# EAGLE board protoBot (EAGLE 6.3), part 1 of 2
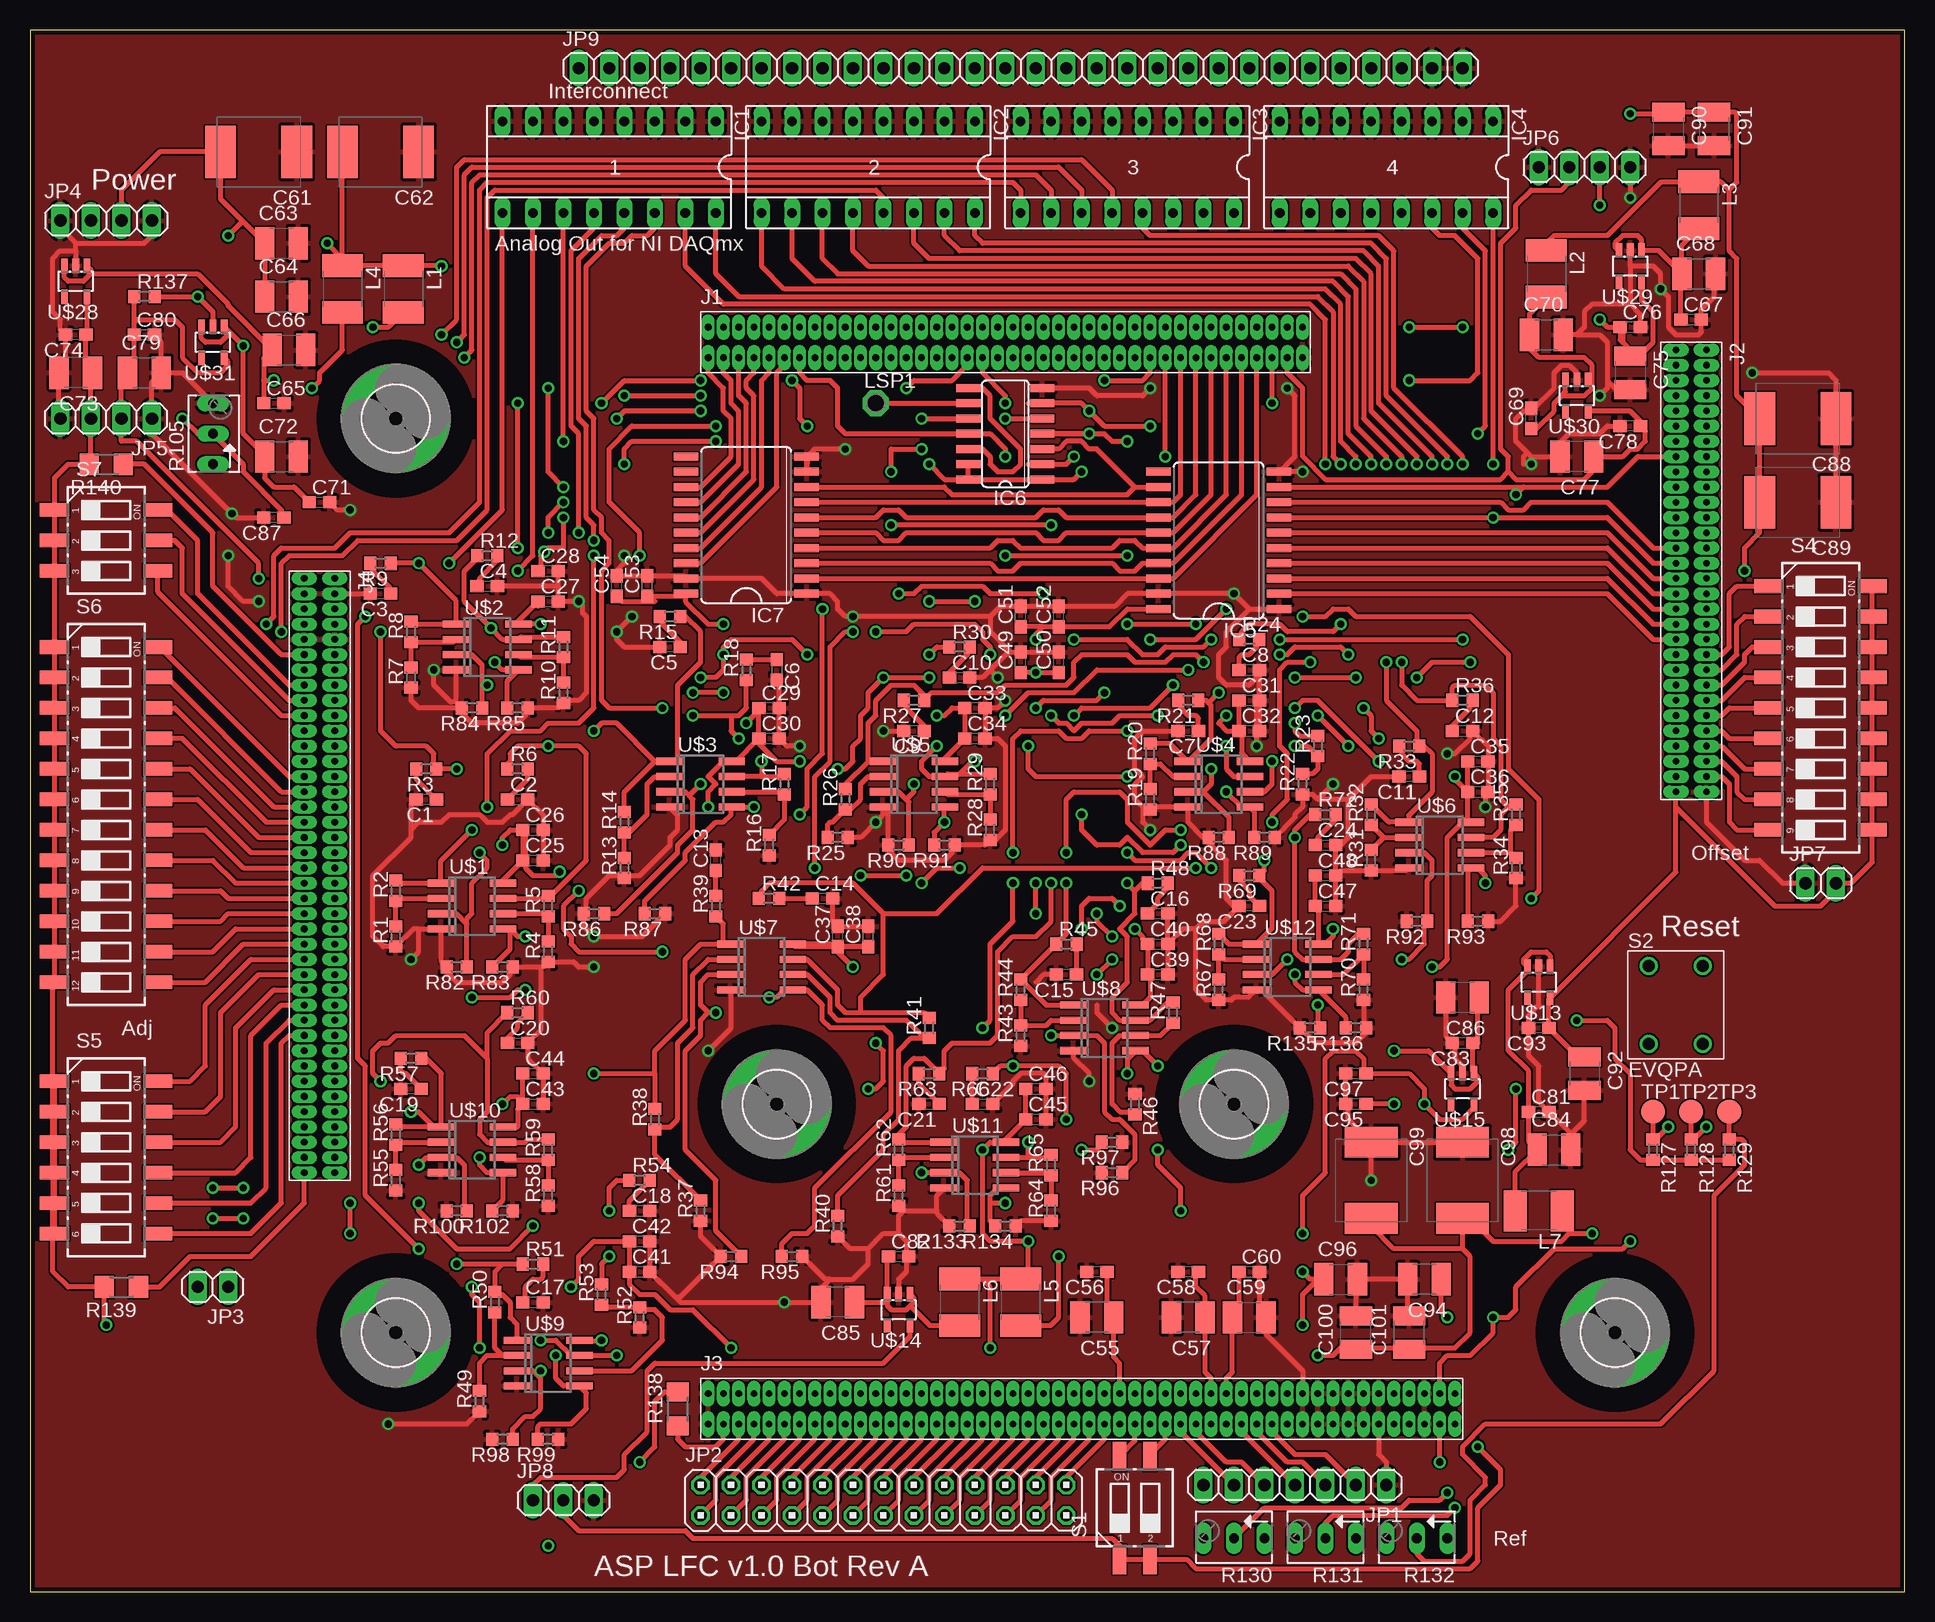
[diagram p6: board, top side]
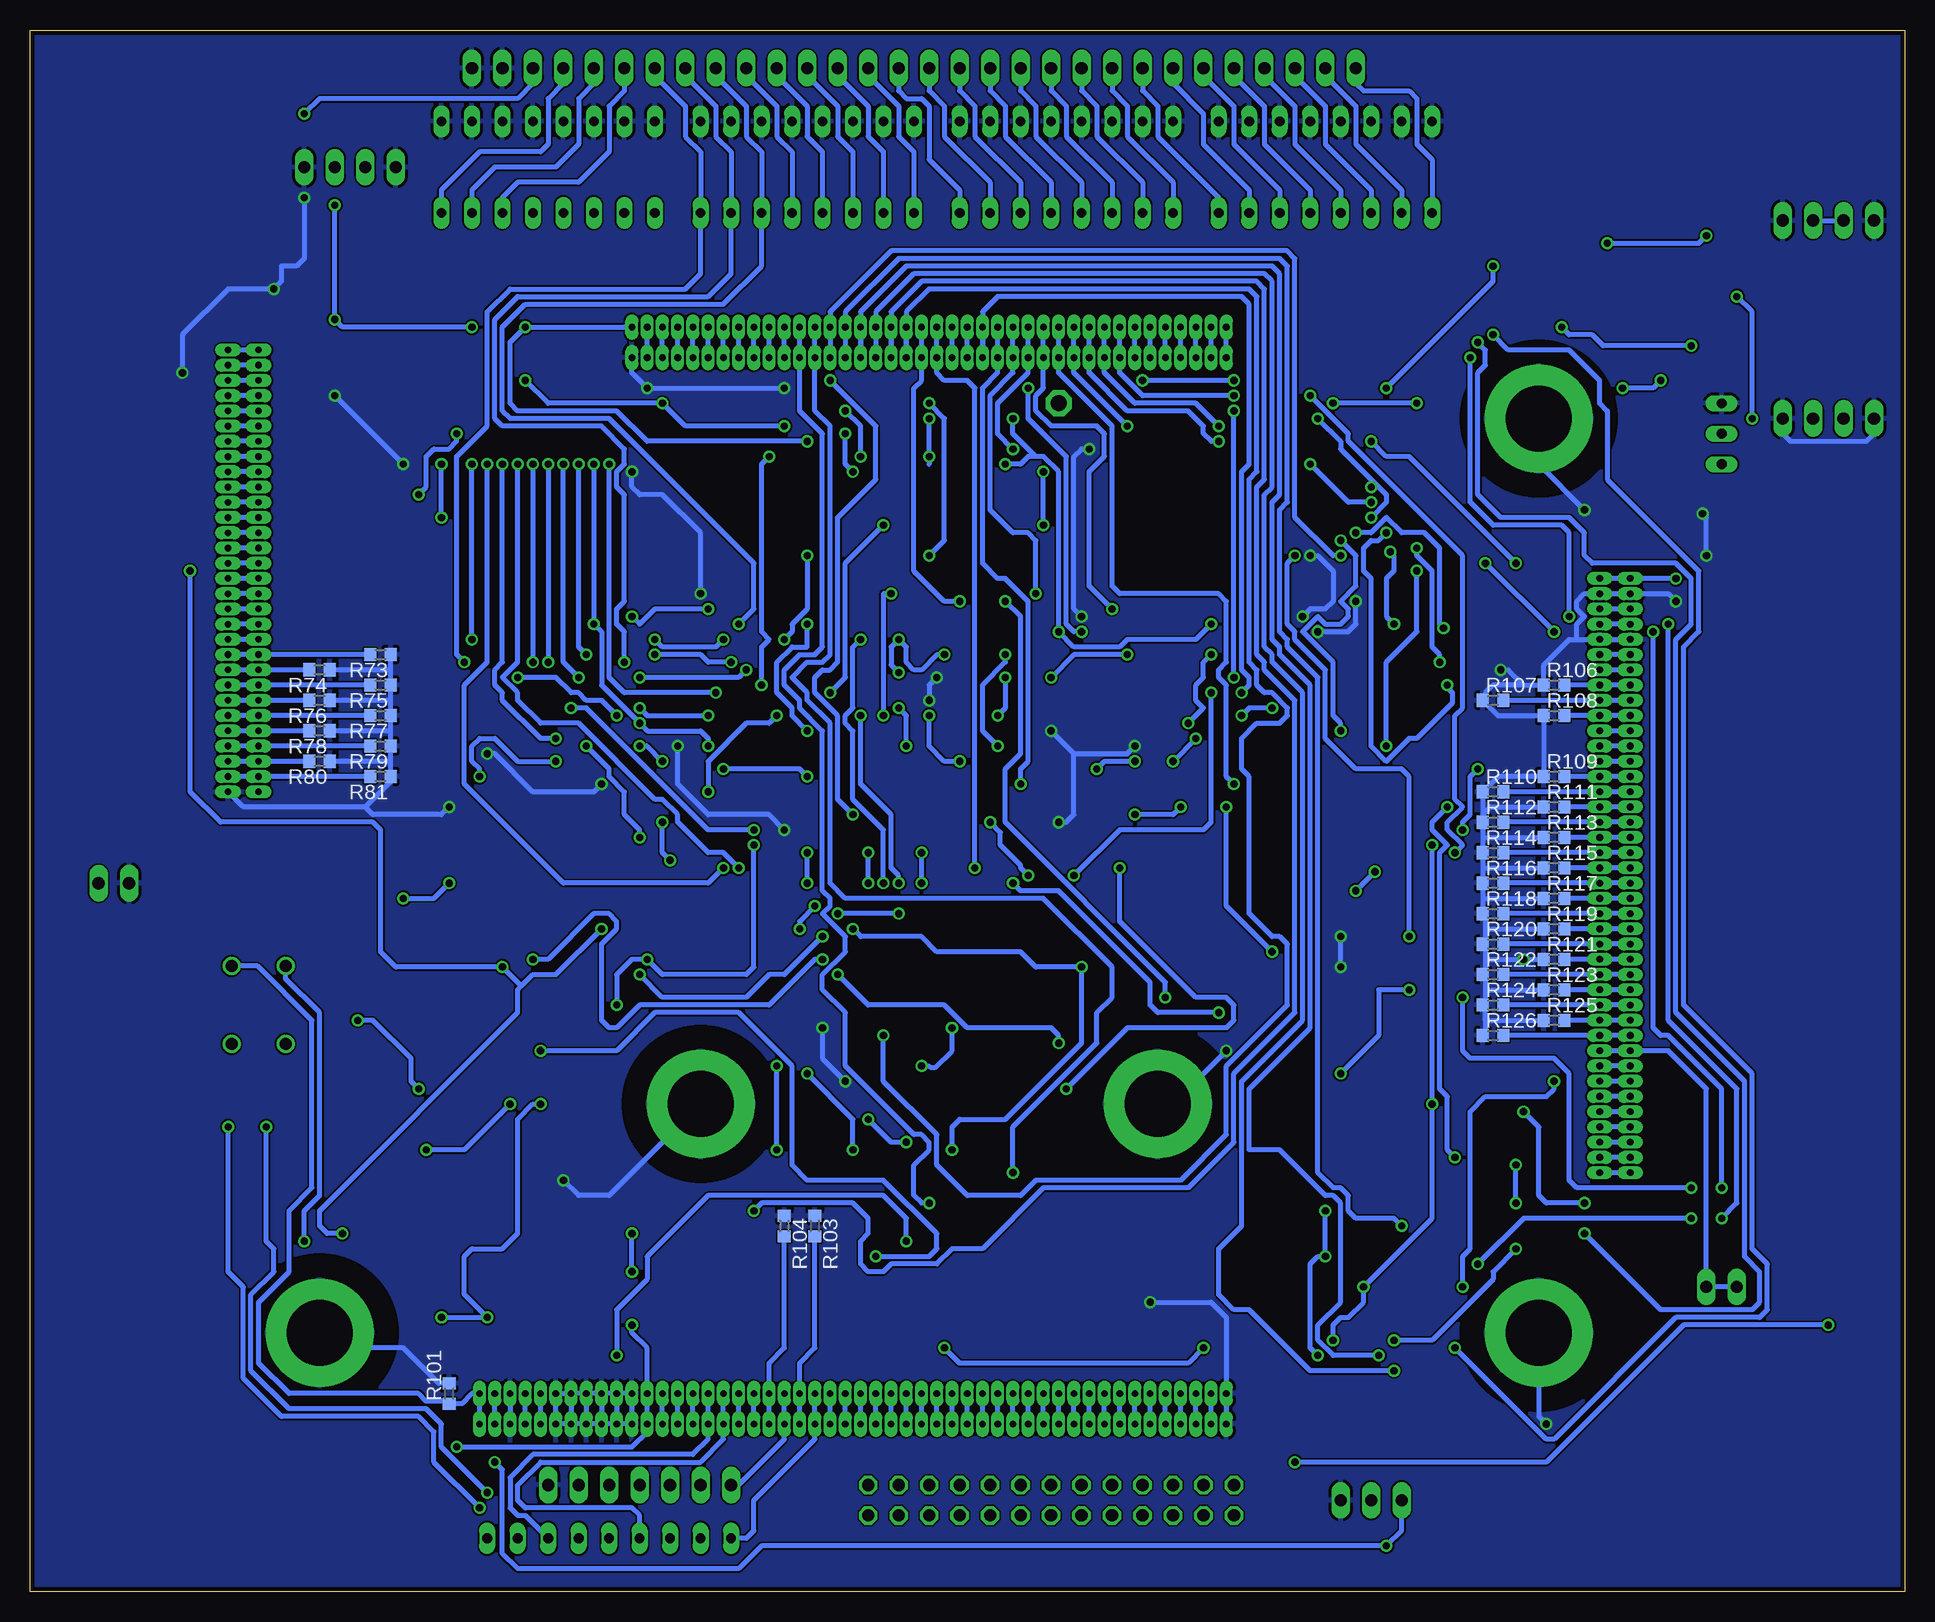
[diagram p7: board, bottom side, seen from below]

Size 156.21 x 130.18 mm. Coordinates in mm from the lower left corner, seen from the top.
Outline: 0,0 156.21,0 156.21,130.18 0,130.18 0,0
Copper layers (1*16): Top 0.035559375mm / dielectric 1.501140625mm / Bottom 0.035559375mm
Design rules "typical_4pcb": minimum track width 10mil, minimum drill 15mil, track to track 6mil, track to pad 6mil, pad to pad 6mil, via to via 6mil, smd to smd 6mil, copper to edge 15mil, drill to drill 8mil, minimum pad ring 10mil, minimum via ring 8mil, stop-mask expansion 4mil, vias tented up to drill 0mil, thermal gap 10mil

## Footprints (pad centres in the part's own frame; a part is rotated, then mirrored left to right if it is on the bottom)
C0603 = smd 1.1 x 1: 1 -0.85,0; 2 0.85,0
C1210 = smd 1.6 x 2.7: 1 -1.4,0; 2 1.4,0
E/7260-38R = smd 2.55 x 4.4: + 3.175,0; - -3.175,0
5,5-PAD = drill 5.5 pad 9: B5,5 0,0
SOCKET-16 = drill 0.813 long: 1 -8.89,-3.81; 2 -6.35,-3.81; 3 -3.81,-3.81; 4 -1.27,-3.81; 5 1.27,-3.81; 6 3.81,-3.81; 7 6.35,-3.81; 8 8.89,-3.81; 9 8.89,3.81; 10 6.35,3.81; 11 3.81,3.81; 12 1.27,3.81; 13 -1.27,3.81; 14 -3.81,3.81; 15 -6.35,3.81; 16 -8.89,3.81
SO20W = smd 0.66 x 2.032: 1 -5.715,-5.029; 2 -4.445,-5.029; 3 -3.175,-5.029; 4 -1.905,-5.029; 5 -0.635,-5.029; 6 0.635,-5.029; 7 1.905,-5.029; 8 3.175,-5.029; 9 4.445,-5.029; 10 5.715,-5.029; 11 5.715,5.029; 12 4.445,5.029; 13 3.175,5.029; 14 1.905,5.029; 15 0.635,5.029; 16 -0.635,5.029; 17 -1.905,5.029; 18 -3.175,5.029; 19 -4.445,5.029; 20 -5.715,5.029
SO14 = smd 0.66 x 2.032: 1 -3.81,-3.073; 2 -2.54,-3.073; 3 -1.27,-3.073; 4 0,-3.073; 5 1.27,-3.073; 6 2.54,-3.073; 7 3.81,-3.073; 8 3.81,3.073; 9 2.54,3.073; 10 1.27,3.073; 11 0,3.073; 12 -1.27,3.073; 13 -2.54,3.073; 14 -3.81,3.073
AMPMODU50-80 = drill 0.559 pad 0.889 long: 1 -24.765,1.27; 2 -24.765,-1.27; 3 -23.495,1.27; 4 -23.495,-1.27; 5 -22.225,1.27; 6 -22.225,-1.27; 7 -20.955,1.27; 8 -20.955,-1.27; 9 -19.685,1.27; 10 -19.685,-1.27; 11 -18.415,1.27; 12 -18.415,-1.27; 13 -17.145,1.27; 14 -17.145,-1.27; 15 -15.875,1.27; 16 -15.875,-1.27; 17 -14.605,1.27; 18 -14.605,-1.27; 19 -13.335,1.27; 20 -13.335,-1.27; 21 -12.065,1.27; 22 -12.065,-1.27; 23 -10.795,1.27; 24 -10.795,-1.27; 25 -9.525,1.27; 26 -9.525,-1.27; 27 -8.255,1.27; 28 -8.255,-1.27; 29 -6.985,1.27; 30 -6.985,-1.27; 31 -5.715,1.27; 32 -5.715,-1.27; 33 -4.445,1.27; 34 -4.445,-1.27; 35 -3.175,1.27; 36 -3.175,-1.27; 37 -1.905,1.27; 38 -1.905,-1.27; 39 -0.635,1.27; 40 -0.635,-1.27; 41 0.635,1.27; 42 0.635,-1.27; 43 1.905,1.27; 44 1.905,-1.27; 45 3.175,1.27; 46 3.175,-1.27; 47 4.445,1.27; 48 4.445,-1.27; 49 5.715,1.27; 50 5.715,-1.27; 51 6.985,1.27; 52 6.985,-1.27; 53 8.255,1.27; 54 8.255,-1.27; 55 9.525,1.27; 56 9.525,-1.27; 57 10.795,1.27; 58 10.795,-1.27; 59 12.065,1.27; 60 12.065,-1.27; 61 13.335,1.27; 62 13.335,-1.27; 63 14.605,1.27; 64 14.605,-1.27; 65 15.875,1.27; 66 15.875,-1.27; 67 17.145,1.27; 68 17.145,-1.27; 69 18.415,1.27; 70 18.415,-1.27; 71 19.685,1.27; 72 19.685,-1.27; 73 20.955,1.27; 74 20.955,-1.27; 75 22.225,1.27; 76 22.225,-1.27; 77 23.495,1.27; 78 23.495,-1.27; 79 24.765,1.27; 80 24.765,-1.27
AMPMODU50-60 = drill 0.559 pad 0.889 long: 1 -18.415,1.27; 2 -18.415,-1.27; 3 -17.145,1.27; 4 -17.145,-1.27; 5 -15.875,1.27; 6 -15.875,-1.27; 7 -14.605,1.27; 8 -14.605,-1.27; 9 -13.335,1.27; 10 -13.335,-1.27; 11 -12.065,1.27; 12 -12.065,-1.27; 13 -10.795,1.27; 14 -10.795,-1.27; 15 -9.525,1.27; 16 -9.525,-1.27; 17 -8.255,1.27; 18 -8.255,-1.27; 19 -6.985,1.27; 20 -6.985,-1.27; 21 -5.715,1.27; 22 -5.715,-1.27; 23 -4.445,1.27; 24 -4.445,-1.27; 25 -3.175,1.27; 26 -3.175,-1.27; 27 -1.905,1.27; 28 -1.905,-1.27; 29 -0.635,1.27; 30 -0.635,-1.27; 31 0.635,1.27; 32 0.635,-1.27; 33 1.905,1.27; 34 1.905,-1.27; 35 3.175,1.27; 36 3.175,-1.27; 37 4.445,1.27; 38 4.445,-1.27; 39 5.715,1.27; 40 5.715,-1.27; 41 6.985,1.27; 42 6.985,-1.27; 43 8.255,1.27; 44 8.255,-1.27; 45 9.525,1.27; 46 9.525,-1.27; 47 10.795,1.27; 48 10.795,-1.27; 49 12.065,1.27; 50 12.065,-1.27; 51 13.335,1.27; 52 13.335,-1.27; 53 14.605,1.27; 54 14.605,-1.27; 55 15.875,1.27; 56 15.875,-1.27; 57 17.145,1.27; 58 17.145,-1.27; 59 18.415,1.27; 60 18.415,-1.27
AMPMODU50-100 = drill 0.559 pad 0.889 long: 1 -31.115,1.27; 2 -31.115,-1.27; 3 -29.845,1.27; 4 -29.845,-1.27; 5 -28.575,1.27; 6 -28.575,-1.27; 7 -27.305,1.27; 8 -27.305,-1.27; 9 -26.035,1.27; 10 -26.035,-1.27; 11 -24.765,1.27; 12 -24.765,-1.27; 13 -23.495,1.27; 14 -23.495,-1.27; 15 -22.225,1.27; 16 -22.225,-1.27; 17 -20.955,1.27; 18 -20.955,-1.27; 19 -19.685,1.27; 20 -19.685,-1.27; 21 -18.415,1.27; 22 -18.415,-1.27; 23 -17.145,1.27; 24 -17.145,-1.27; 25 -15.875,1.27; 26 -15.875,-1.27; 27 -14.605,1.27; 28 -14.605,-1.27; 29 -13.335,1.27; 30 -13.335,-1.27; 31 -12.065,1.27; 32 -12.065,-1.27; 33 -10.795,1.27; 34 -10.795,-1.27; 35 -9.525,1.27; 36 -9.525,-1.27; 37 -8.255,1.27; 38 -8.255,-1.27; 39 -6.985,1.27; 40 -6.985,-1.27; 41 -5.715,1.27; 42 -5.715,-1.27; 43 -4.445,1.27; 44 -4.445,-1.27; 45 -3.175,1.27; 46 -3.175,-1.27; 47 -1.905,1.27; 48 -1.905,-1.27; 49 -0.635,1.27; 50 -0.635,-1.27; 51 0.635,1.27; 52 0.635,-1.27; 53 1.905,1.27; 54 1.905,-1.27; 55 3.175,1.27; 56 3.175,-1.27; 57 4.445,1.27; 58 4.445,-1.27; 59 5.715,1.27; 60 5.715,-1.27; 61 6.985,1.27; 62 6.985,-1.27; 63 8.255,1.27; 64 8.255,-1.27; 65 9.525,1.27; 66 9.525,-1.27; 67 10.795,1.27; 68 10.795,-1.27; 69 12.065,1.27; 70 12.065,-1.27; 71 13.335,1.27; 72 13.335,-1.27; 73 14.605,1.27; 74 14.605,-1.27; 75 15.875,1.27; 76 15.875,-1.27; 77 17.145,1.27; 78 17.145,-1.27; 79 18.415,1.27; 80 18.415,-1.27; 81 19.685,1.27; 82 19.685,-1.27; 83 20.955,1.27; 84 20.955,-1.27; 85 22.225,1.27; 86 22.225,-1.27; 87 23.495,1.27; 88 23.495,-1.27; 89 24.765,1.27; 90 24.765,-1.27; 91 26.035,1.27; 92 26.035,-1.27; 93 27.305,1.27; 94 27.305,-1.27; 95 28.575,1.27; 96 28.575,-1.27; 97 29.845,1.27; 98 29.845,-1.27; 99 31.115,1.27; 100 31.115,-1.27
1X07 = drill 1.016 long: 1 -7.62,0; 2 -5.08,0; 3 -2.54,0; 4 0,0; 5 2.54,0; 6 5.08,0; 7 7.62,0
2X13 = drill 1.016 octagon: 1 -15.24,-1.27; 2 -15.24,1.27; 3 -12.7,-1.27; 4 -12.7,1.27; 5 -10.16,-1.27; 6 -10.16,1.27; 7 -7.62,-1.27; 8 -7.62,1.27; 9 -5.08,-1.27; 10 -5.08,1.27; 11 -2.54,-1.27; 12 -2.54,1.27; 13 0,-1.27; 14 0,1.27; 15 2.54,-1.27; 16 2.54,1.27; 17 5.08,-1.27; 18 5.08,1.27; 19 7.62,-1.27; 20 7.62,1.27; 21 10.16,-1.27; 22 10.16,1.27; 23 12.7,-1.27; 24 12.7,1.27; 25 15.24,-1.27; 26 15.24,1.27
1X02 = drill 1.016 long: 1 -1.27,0; 2 1.27,0
1X04 = drill 1.016 long: 1 -3.81,0; 2 -1.27,0; 3 1.27,0; 4 3.81,0
1X03 = drill 1.016 long: 1 -2.54,0; 2 0,0; 3 2.54,0
1X30 = drill 1.016 long: 1 -36.83,0; 2 -34.29,0; 3 -31.75,0; 4 -29.21,0; 5 -26.67,0; 6 -24.13,0; 7 -21.59,0; 8 -19.05,0; 9 -16.51,0; 10 -13.97,0; 11 -11.43,0; 12 -8.89,0; 13 -6.35,0; 14 -3.81,0; 15 -1.27,0; 16 1.27,0; 17 3.81,0; 18 6.35,0; 19 8.89,0; 20 11.43,0; 21 13.97,0; 22 16.51,0; 23 19.05,0; 24 21.59,0; 25 24.13,0; 26 26.67,0; 27 29.21,0; 28 31.75,0; 29 34.29,0; 30 36.83,0
L1812 = smd 1.9 x 3.4: 1 -1.95,0; 2 1.95,0
P1-13 = drill 1.321 pad 2.159 octagon: 1 0,0
R0603 = smd 1 x 1.1: 1 -0.85,0; 2 0.85,0
B64Y = drill 0.813 long: A 2.54,0; E -2.54,0; S 0,0
R1206 = smd 1.6 x 1.803: 1 -1.422,0; 2 1.422,0
CTS-219-02 = smd 1.13 x 2.44: 1 -1.27,-4.3; 2 1.27,-4.3; 3 1.27,4.3; 4 -1.27,4.3
EVQPA = drill 1: A -2.25,3.25; A' -2.25,-3.25; B 2.25,3.25; B' 2.25,-3.25
CTS-219-09 = smd 1.13 x 2.44: 1 -10.16,-4.3; 2 -7.62,-4.3; 3 -5.08,-4.3; 4 -2.54,-4.3; 5 0,-4.3; 6 2.54,-4.3; 7 5.08,-4.3; 8 7.62,-4.3; 9 10.16,-4.3; 10 10.16,4.3; 11 7.62,4.3; 12 5.08,4.3; 13 2.54,4.3; 14 0,4.3; 15 -2.54,4.3; 16 -5.08,4.3; 17 -7.62,4.3; 18 -10.16,4.3
CTS-219-06 = smd 1.13 x 2.44: 1 -6.35,-4.3; 2 -3.81,-4.3; 3 -1.27,-4.3; 4 1.27,-4.3; 5 3.81,-4.3; 6 6.35,-4.3; 7 6.35,4.3; 8 3.81,4.3; 9 1.27,4.3; 10 -1.27,4.3; 11 -3.81,4.3; 12 -6.35,4.3
CTS-219-12 = smd 1.13 x 2.44: 1 -13.97,-4.3; 2 -11.43,-4.3; 3 -8.89,-4.3; 4 -6.35,-4.3; 5 -3.81,-4.3; 6 -1.27,-4.3; 7 1.27,-4.3; 8 3.81,-4.3; 9 6.35,-4.3; 10 8.89,-4.3; 11 11.43,-4.3; 12 13.97,-4.3; 13 13.97,4.3; 14 11.43,4.3; 15 8.89,4.3; 16 6.35,4.3; 17 3.81,4.3; 18 1.27,4.3; 19 -1.27,4.3; 20 -3.81,4.3; 21 -6.35,4.3; 22 -8.89,4.3; 23 -11.43,4.3; 24 -13.97,4.3
CTS-219-03 = smd 1.13 x 2.44: 1 -2.54,-4.3; 2 0,-4.3; 3 2.54,-4.3; 4 2.54,4.3; 5 0,4.3; 6 -2.54,4.3
TP20R = smd 2 x 2: TP 0,0
SOIC-8 = smd 0.6 x 2.2: 1 -1.905,-2.6; 2 -0.635,-2.6; 3 0.635,-2.6; 4 1.905,-2.6; 5 1.905,2.6; 6 0.635,2.6; 7 -0.635,2.6; 8 -1.905,2.6
TSOT23-5 = smd 0.55 x 1.2: 1 -0.95,-1.3; 2 0,-1.3; 3 0.95,-1.3; 4 0.95,1.3; 5 -0.95,1.3

## Placement (x,y rotation side)
C1  [C0603]  33.02,66.04 180 top
C2  [C0603]  40.64,66.04 0 top
C3  [C0603]  29.21,83.19 180 top
C4  [C0603]  38.1,83.82 0 top
C5  [C0603]  53.34,78.74 180 top
C6  [C0603]  62.23,76.83 270 top
C7  [C0603]  96.52,71.75 180 top
C8  [C0603]  101.6,76.83 0 top
C9  [C0603]  73.66,71.75 180 top
C10  [C0603]  77.47,76.2 0 top
C11  [C0603]  114.94,67.94 180 top
C12  [C0603]  119.38,71.75 0 top
C13  [C0603]  57.15,60.96 90 top
C14  [C0603]  66.04,57.78 0 top
C15  [C0603]  86.36,51.43 180 top
C16  [C0603]  93.98,56.52 0 top
C17  [C0603]  41.91,24.13 0 top
C18  [C0603]  50.8,31.75 0 top
C19  [C0603]  31.75,41.91 180 top
C20  [C0603]  40.64,45.72 0 top
C21  [C0603]  74.93,40.64 180 top
C22  [C0603]  79.38,40.64 0 top
C23  [C0603]  101.6,57.15 180 top
C24  [C0603]  107.95,62.23 0 top
C25  [C0603]  41.91,60.96 0 top
C26  [C0603]  41.91,63.5 0 top
C27  [C0603]  43.18,82.55 0 top
C28  [C0603]  43.18,85.09 0 top
C29  [C0603]  61.59,73.66 0 top
C30  [C0603]  61.59,71.12 0 top
C31  [C0603]  101.6,74.3 0 top
C32  [C0603]  101.6,71.75 0 top
C33  [C0603]  78.74,73.66 0 top
C34  [C0603]  78.74,71.12 0 top
C35  [C0603]  120.65,69.22 0 top
C36  [C0603]  120.65,66.67 0 top
C37  [C0603]  67.31,54.61 90 top
C38  [C0603]  69.85,54.61 90 top
C39  [C0603]  93.98,51.43 0 top
C40  [C0603]  93.98,53.97 0 top
C41  [C0603]  50.8,26.67 0 top
C42  [C0603]  50.8,29.21 0 top
C43  [C0603]  41.91,40.64 0 top
C44  [C0603]  41.91,43.18 0 top
C45  [C0603]  83.82,39.37 0 top
C46  [C0603]  83.82,41.91 0 top
C47  [C0603]  107.95,57.15 0 top
C48  [C0603]  107.95,59.69 0 top
C49  [C0603]  82.55,77.47 90 top
C50  [C0603]  85.72,77.47 90 top
C51  [C0603]  82.55,81.28 90 top
C52  [C0603]  85.72,81.28 90 top
C53  [C0603]  51.44,83.82 90 top
C54  [C0603]  48.89,83.82 90 top
C55  [C1210]  88.9,22.86 180 top
C56  [C0603]  88.9,26.67 180 top
C57  [C1210]  96.52,22.86 180 top
C58  [C0603]  96.52,26.67 180 top
C59  [C1210]  101.6,22.86 0 top
C60  [C0603]  101.6,26.67 0 top
C61  [E/7260-38R]  19.05,120.02 180 top
C62  [E/7260-38R]  29.21,120.02 180 top
C63  [C1210]  20.96,112.39 0 top
C64  [C1210]  20.96,107.95 0 top
C65  [C0603]  20.32,99.06 0 top
C66  [C1210]  21.59,103.5 0 top
C67  [C0603]  138.43,106.05 0 top
C68  [C1210]  139.06,109.86 0 top
C69  [C0603]  125.09,97.79 90 top
C70  [C1210]  126.36,104.77 0 top
C71  [C0603]  24.13,90.8 0 top
C72  [C1210]  20.96,94.61 0 top
C73  [C1210]  3.81,101.6 180 top
C74  [C0603]  3.81,104.77 180 top
C75  [C1210]  133.35,101.6 270 top
C76  [C0603]  133.35,105.41 0 top
C77  [C1210]  128.91,94.61 180 top
C78  [C0603]  133.35,97.16 180 top
C79  [C1210]  9.53,101.6 0 top
C80  [C0603]  9.53,104.77 0 top
C81  [C0603]  125.73,40 0 top
C82  [C0603]  72.39,27.94 0 top
C83  [C0603]  119.38,45.72 180 top
C84  [C1210]  127,36.83 0 top
C85  [C1210]  67.31,24.13 180 top
C86  [C1210]  119.38,49.53 180 top
C87  [C0603]  20.32,89.53 180 top
C88  [E/7260-38R]  147.32,97.79 180 top
C89  [E/7260-38R]  147.32,90.8 180 top
C90  [C1210]  136.53,121.92 270 top
C91  [C1210]  140.34,121.92 270 top
C92  [C1210]  129.54,43.18 270 top
C93  [C0603]  125.73,46.99 180 top
C94  [C1210]  116.2,26.04 180 top
C95  [C0603]  110.49,40.64 180 top
C96  [C1210]  109.22,26.04 0 top
C97  [C0603]  110.49,43.18 180 top
C98  [E/7260-38R]  119.38,34.29 270 top
C99  [E/7260-38R]  111.76,34.29 270 top
C100  [C1210]  110.49,21.59 90 top
C101  [C1210]  114.94,21.59 90 top
H1  MOUNT-PAD-ROUND5.5  [5,5-PAD]  30.48,21.59 0 top
H2  MOUNT-PAD-ROUND5.5  [5,5-PAD]  62.23,40.64 0 top
H3  MOUNT-PAD-ROUND5.5  [5,5-PAD]  100.33,40.64 0 top
H4  MOUNT-PAD-ROUND5.5  [5,5-PAD]  132.08,21.59 0 top
H5  MOUNT-PAD-ROUND5.5  [5,5-PAD]  30.48,97.79 0 top
IC1  [SOCKET-16]  48.26,118.75 180 top
IC2  [SOCKET-16]  69.85,118.75 180 top
IC3  [SOCKET-16]  91.44,118.75 180 top
IC4  [SOCKET-16]  113.03,118.75 180 top
IC5  74LS540DW  [SO20W]  99.06,87.63 90 top
IC6  74LS74D  [SO14]  81.28,96.52 90 top
IC7  74LS540DW  [SO20W]  59.69,88.9 90 top
J1  AMPMODU50-80  [AMPMODU50-80]  81.28,104.14 0 top
J2  AMPMODU50-60  [AMPMODU50-60]  138.43,85.09 270 top
J3  AMPMODU50-100  [AMPMODU50-100]  87.63,15.24 0 top
J4  AMPMODU50-80  [AMPMODU50-80]  24.13,59.69 270 top
JP1  [1X07]  105.41,8.89 180 top
JP2  [2X13]  71.12,7.62 0 top
JP3  [1X02]  15.24,25.4 180 top
JP4  [1X04]  6.35,114.3 0 top
JP5  [1X04]  6.35,97.79 180 top
JP6  [1X04]  129.54,118.75 0 top
JP7  [1X02]  149.22,59.05 0 top
JP8  [1X03]  44.45,7.62 0 top
JP9  [1X30]  82.55,127 0 top
L1  [L1812]  31.12,108.58 270 top
L2  [L1812]  126.36,109.86 270 top
L3  [L1812]  139.06,115.57 270 top
L4  [L1812]  26.04,108.58 270 top
L5  [L1812]  82.55,24.13 270 top
L6  [L1812]  77.47,24.13 270 top
L7  [L1812]  125.73,31.75 180 top
LSP1  TPSPAD1-13  [P1-13]  70.48,99.06 0 top
R1  10K  [R0603]  30.48,54.61 90 top
R2  20K  [R0603]  30.48,58.42 90 top
R3  [R0603]  33.02,68.58 180 top
R4  10K  [R0603]  43.18,53.34 90 top
R5  20K  [R0603]  43.18,57.15 90 top
R6  [R0603]  40.64,68.58 0 top
R7  10K  [R0603]  31.75,76.2 90 top
R8  20K  [R0603]  31.75,80.01 90 top
R9  [R0603]  29.21,85.72 180 top
R10  10K  [R0603]  44.45,74.93 90 top
R11  20K  [R0603]  44.45,78.74 90 top
R12  [R0603]  38.1,86.36 0 top
R13  10K  [R0603]  49.53,60.33 90 top
R14  20K  [R0603]  49.53,64.13 90 top
R15  [R0603]  53.34,81.28 180 top
R16  10K  [R0603]  61.59,62.23 90 top
R17  20K  [R0603]  62.87,67.31 90 top
R18  [R0603]  59.69,76.83 90 top
R19  10K  [R0603]  93.34,66.04 90 top
R20  20K  [R0603]  93.34,69.85 90 top
R21  [R0603]  96.52,74.3 180 top
R22  10K  [R0603]  106.05,67.31 90 top
R23  20K  [R0603]  107.31,70.48 90 top
R24  [R0603]  101.6,79.38 0 top
R25  10K  [R0603]  67.31,62.86 180 top
R26  20K  [R0603]  67.94,66.04 90 top
R27  [R0603]  73.66,74.3 180 top
R28  10K  [R0603]  80.01,63.5 90 top
R29  20K  [R0603]  80.01,67.31 90 top
R30  [R0603]  77.47,78.74 0 top
R31  10K  [R0603]  111.76,60.96 90 top
R32  20K  [R0603]  111.76,64.77 90 top
R33  [R0603]  114.94,70.48 180 top
R34  10K  [R0603]  123.83,60.33 90 top
R35  20K  [R0603]  123.83,64.77 90 top
R36  [R0603]  119.38,74.3 0 top
R37  10K  [R0603]  55.88,31.75 90 top
R38  20K  [R0603]  52.07,39.37 90 top
R39  [R0603]  57.15,57.15 90 top
R40  10K  [R0603]  67.31,30.48 90 top
R41  20K  [R0603]  74.93,46.99 90 top
R42  [R0603]  61.59,57.78 0 top
R43  10K  [R0603]  82.55,46.35 90 top
R44  20K  [R0603]  82.55,50.16 90 top
R45  [R0603]  86.36,53.97 0 top
R46  10K  [R0603]  92.08,40.64 270 top
R47  20K  [R0603]  95.25,48.26 90 top
R48  [R0603]  93.98,59.05 0 top
R49  10K  [R0603]  37.47,15.87 90 top
R50  20K  [R0603]  38.73,24.13 90 top
R51  [R0603]  41.91,27.3 0 top
R52  10K  [R0603]  50.8,22.86 90 top
R53  20K  [R0603]  47.62,24.77 90 top
R54  [R0603]  50.8,34.29 0 top
R55  10K  [R0603]  30.48,34.29 90 top
R56  20K  [R0603]  30.48,38.1 90 top
R57  [R0603]  31.75,44.45 180 top
R58  10K  [R0603]  43.18,33.02 90 top
R59  20K  [R0603]  43.18,36.83 90 top
R60  [R0603]  40.64,48.26 0 top
R61  10K  [R0603]  72.39,33.02 90 top
R62  20K  [R0603]  72.39,36.83 90 top
R63  [R0603]  74.93,43.18 180 top
R64  10K  [R0603]  85.09,31.75 90 top
R65  20K  [R0603]  85.09,35.56 90 top
R66  [R0603]  79.38,43.18 180 top
R67  10K  [R0603]  99.06,50.16 90 top
R68  20K  [R0603]  99.06,53.97 90 top
R69  [R0603]  101.6,59.69 180 top
R70  10K  [R0603]  111.12,50.16 90 top
R71  20K  [R0603]  111.12,53.97 90 top
R72  [R0603]  107.95,64.77 0 top
R73  10K  [R0603]  127,78.11 180 bottom
R74  10K  [R0603]  132.08,76.83 180 bottom
R75  [R0603]  127,75.56 180 bottom
R76  [R0603]  132.08,74.3 180 bottom
R77  [R0603]  127,73.02 180 bottom
R78  [R0603]  132.08,71.75 180 bottom
R79  [R0603]  127,70.48 180 bottom
R80  [R0603]  132.08,69.22 180 bottom
R81  [R0603]  127,67.94 180 bottom
R82  110K  [R0603]  35.56,52.07 180 top
R83  110K  [R0603]  39.37,52.07 180 top
R84  110K  [R0603]  36.83,73.66 180 top
R85  110K  [R0603]  40.64,73.66 180 top
R86  110K  [R0603]  46.99,56.52 180 top
R87  110K  [R0603]  52.07,56.52 180 top
R88  110K  [R0603]  99.06,62.86 180 top
R89  110K  [R0603]  102.87,62.86 180 top
R90  110K  [R0603]  72.39,62.23 180 top
R91  110K  [R0603]  76.2,62.23 180 top
R92  110K  [R0603]  115.57,55.88 180 top
R93  110K  [R0603]  120.65,55.88 180 top
R94  110K  [R0603]  58.42,27.94 180 top
R95  110K  [R0603]  63.5,27.94 180 top
R96  110K  [R0603]  90.17,34.92 180 top
R97  110K  [R0603]  90.17,37.46 180 top
R98  110K  [R0603]  39.37,12.7 180 top
R99  110K  [R0603]  43.18,12.7 180 top
R100  110K  [R0603]  35.56,31.75 180 top
R101  10K  [R0603]  121.28,16.51 90 bottom
R102  110K  [R0603]  39.37,31.75 180 top
R103  10K  [R0603]  90.81,30.48 270 bottom
R104  [R0603]  93.34,30.48 270 bottom
R105  [B64Y]  15.24,96.52 90 top
R106  [R0603]  29.21,75.56 0 bottom
R107  [R0603]  34.29,74.3 0 bottom
R108  [R0603]  29.21,73.02 0 bottom
R109  [R0603]  29.21,67.94 0 bottom
R110  [R0603]  34.29,66.67 0 bottom
R111  [R0603]  29.21,65.41 0 bottom
R112  [R0603]  34.29,64.13 0 bottom
R113  [R0603]  29.21,62.86 0 bottom
R114  [R0603]  34.29,61.59 0 bottom
R115  [R0603]  29.21,60.33 0 bottom
R116  [R0603]  34.29,59.05 0 bottom
R117  [R0603]  29.21,57.78 0 bottom
R118  [R0603]  34.29,56.52 0 bottom
R119  [R0603]  29.21,55.24 0 bottom
R120  [R0603]  34.29,53.97 0 bottom
R121  [R0603]  29.21,52.7 0 bottom
R122  [R0603]  34.29,51.43 0 bottom
R123  [R0603]  29.21,50.16 0 bottom
R124  [R0603]  34.29,48.89 0 bottom
R125  [R0603]  29.21,47.62 0 bottom
R126  [R0603]  34.29,46.35 0 bottom
R127  10k  [R0603]  135.25,36.83 270 top
R128  10k  [R0603]  138.43,36.83 270 top
R129  10k  [R0603]  141.61,36.83 270 top
R130  [B64Y]  100.33,4.45 180 top
R131  [B64Y]  107.95,4.45 180 top
R132  [B64Y]  115.57,4.45 180 top
R133  110K  [R0603]  77.47,30.48 180 top
R134  110K  [R0603]  81.28,30.48 180 top
R135  110K  [R0603]  106.68,46.99 180 top
R136  110K  [R0603]  110.49,46.99 180 top
R137  1k  [R0603]  9.53,107.95 0 top
R138  open  [R1206]  53.98,15.24 90 top
R139  open  [R1206]  7.62,25.4 180 top
R140  open  [R1206]  6.35,93.98 180 top
S1  219-02  [CTS-219-02]  92.08,6.98 0 top
S2  EVQPA  [EVQPA]  137.16,48.89 0 top
S4  219-09  [CTS-219-09]  149.22,73.66 270 top
S5  219-06  [CTS-219-06]  6.35,36.2 270 top
S6  219-12  [CTS-219-12]  6.35,64.77 270 top
S7  219-03  [CTS-219-03]  6.35,87.63 270 top
TP1  TPTP20R  [TP20R]  135.25,40 0 top
TP2  TPTP20R  [TP20R]  138.43,40 0 top
TP3  TPTP20R  [TP20R]  141.61,40 0 top
U$1  AD823  [SOIC-8]  36.83,57.15 270 top
U$2  AD823  [SOIC-8]  38.1,78.74 270 top
U$3  AD823  [SOIC-8]  55.88,67.31 270 top
U$4  AD823  [SOIC-8]  99.06,67.31 270 top
U$5  AD823  [SOIC-8]  73.66,67.31 270 top
U$6  AD823  [SOIC-8]  117.47,62.23 270 top
U$7  AD823  [SOIC-8]  60.96,52.07 270 top
U$8  AD823  [SOIC-8]  89.53,46.99 270 top
U$9  AD823  [SOIC-8]  43.18,19.05 270 top
U$10  AD823  [SOIC-8]  36.83,36.83 270 top
U$11  AD823  [SOIC-8]  78.74,35.56 270 top
U$12  AD823  [SOIC-8]  104.78,52.07 270 top
U$13  ADP151  [TSOT23-5]  125.73,50.8 180 top
U$14  ADP151  [TSOT23-5]  72.39,23.5 180 top
U$15  ADP151  [TSOT23-5]  119.38,41.91 180 top
U$28  ADP151  [TSOT23-5]  3.81,109.22 180 top
U$29  ADP151  [TSOT23-5]  133.35,110.49 180 top
U$30  ADP151  [TSOT23-5]  128.91,99.69 180 top
U$31  ADP151  [TSOT23-5]  15.24,104.14 180 top

## Tracks (layer width: path | path; a pad name or v marks a point on that pad's centre or on a via)
1V8A
  Top 0.406: C92.1 128.99,44.58 C93.1 126.58,49.4 U$13.5 137.16,59.98 137.16,65.41 | S4.18 S4.17 S4.16 S4.15 S4.14 S4.13 S4.12 S4.11 S4.10 153.53,60.81 151.77,59.05 JP7.2 150.5,58.42 149.22,57.15 145.42,57.15 137.16,65.41 | 137.16,65.41 J2.60
1V8B  (via drill 0.6)
  Top 0.406: C94.1 117.61,23.37 v118.11,22.86 | J3.97 117.47,19.05 118.11,19.69 120.02,19.69 121.92,21.59 v121.92,22.86 123.19,22.86 123.83,23.5 123.83,25.4 127,28.57 132.72,28.57 v133.35,29.21 | U$14.5 73.34,21.27 71.12,19.05 52.07,19.05 51.44,18.42 51.44,13.33 49.53,11.43 49.53,10.16 48.89,9.53 42.55,9.53 41.91,8.89 JP8.1 | v113.67,40.64 C95.1 | v117.47,10.79 J3.98
  Bottom 0.406: J3.98 J3.97 | v121.92,22.86 v118.11,22.86 120.02,24.77 120.02,27.94 119.38,28.57 116.84,28.57 115.57,29.85 115.57,39.37 114.3,40.64 v113.67,40.64 | S2.A 134.91,51.09 132.08,48.26 132.08,33.02 133.35,31.75 v133.35,29.21 | JP8.1 41.91,5.08 v43.18,3.81 95.25,3.81 97.16,1.9 115.57,1.9 116.84,3.18 116.84,10.16 v117.47,10.79
1V8C  (via drill 0.6)
  Top 0.406: 107.31,26.04 C96.1 | 107.31,26.04 106.05,24.77 v106.05,22.23 | U$15.5 120.33,40.32 119.38,39.37 117.47,39.37 v116.2,40.64 116.2,41.91 114.94,43.18 C97.1 111.12,43.39 111.12,44.45 110.49,45.09 108.59,45.09 107.95,44.45 107.95,34.92 106.05,33.02 v106.05,29.85 | 107.31,26.04 106.68,26.04 v106.05,26.67 | JP8.2 44.45,6.35 45.72,5.08 54.61,5.08 55.25,4.45 90.17,4.45 90.81,3.81 S1.1 S1.2 96.38,2.69 97.16,1.9 120.02,1.9 120.65,2.54 120.65,6.98 122.56,8.89 122.56,10.16 v120.65,12.06 | R129.2 R128.2 R127.2 134.2,35.98 133.35,36.83 133.35,43.18 132.08,44.45 132.08,46.99 131.44,47.62 v128.91,47.62 | v123.83,41.91 123.83,37.46 v123.19,36.83
  Bottom 0.406: v106.05,22.23 106.05,21.59 104.78,20.32 J3.77 J3.78 104.78,13.33 106.05,12.06 v120.65,12.06 | v106.05,26.67 v106.05,29.85 | v128.91,47.62 127.64,47.62 124.46,44.45 124.46,42.54 v123.83,41.91 | v123.19,36.83 120.02,36.83 v116.2,40.64
1V8D
  Top 0.406: R138.1 53.98,12.7 54.61,12.06 57.15,12.06 57.79,12.7 J3.4
  Bottom 0.406: J3.4 J3.3
1V8E
  Top 0.406: R139.1 10.8,25.4 13.34,27.94 18.42,27.94 22.86,32.38 J4.80
  Bottom 0.406: J4.80 J4.79
1V8F
  Top 0.406: R140.1 9.53,93.98 15.24,88.27 15.24,83.82 20.96,78.11 J4.12
  Bottom 0.406: J4.12 J4.11
1V8MAIN  (via drill 0.6)
  Top 0.406: 1.91,29.99 1.91,26.67 3.18,25.4 R139.2 6.2,22.38 v6.35,22.23 | 1.91,42.4 S5.1 2.05,40.15 1.91,40 | 1.91,34.78 1.91,37.46 | 1.91,37.46 1.91,40 | 1.91,40 1.91,42.4 | 1.91,29.99 S5.6 S5.2 | 1.91,29.99 1.91,32.53 | 1.91,34.78 S5.4 | 1.91,34.78 1.91,32.53 | 1.91,32.53 S5.5 | 1.91,37.46 S5.3 | 1.91,42.4 1.91,50.66 S6.12 S6.11 S6.10 S6.9 S6.8 S6.7 S6.6 S6.5 S6.4 S6.3 S6.2 S6.1 S7.3 S7.2 S7.1 2.05,92.86 3.18,93.98 R140.2 5.08,94.13 JP5.3 5.08,101.47 C73.1 4.66,102.15 C74.1 4.76,104.88 U$28.5 | v50.8,10.79 52.07,12.06 52.07,15.87 52.86,16.66 R138.2
  Bottom 0.406: v6.35,22.23 18.42,22.23 29.84,10.79 v50.8,10.79
3V3A  (via drill 0.6)
  Top 0.406: v19.05,84.45 19.05,85.72 8.89,95.88 7.62,95.88 JP5.2 7.62,101.09 C79.1 8.68,102.15 C80.1 | C80.1 R137.1 | C80.1 8.68,105.83 8.89,106.05 12.07,106.05 12.7,105.41 12.7,102.87 13.97,101.6 15.88,101.6 16.51,102.23 16.51,102.52 U$31.5
  Bottom 0.406: J4.1 J4.2 v19.05,84.45
3V3B
  Top 0.406: J1.78 104.78,101.6 106.05,100.33 106.05,94.61 107.95,92.71 122.56,92.71 123.19,93.34 | JP6.2 128.27,117.47 127.64,116.84 125.09,116.84 123.83,115.57 123.83,113.66 122.56,112.39 122.56,95.25 123.19,94.61 123.19,93.34 | 123.19,93.34 123.83,92.71 129.54,92.71 130.18,93.34 130.18,94.48 C77.1 132.72,94.61 133.35,95.25 133.99,95.25 134.62,95.88 134.62,96.73 C78.1 134.2,97.58 133.35,98.42 129.88,98.42 U$30.5
  Bottom 0.406: J1.78 J1.77
3V3C  (via drill 0.6)
  Top 0.406: IC6.14 IC6.13 | IC6.14 IC6.1 87,92.71 v87.63,93.34 | IC6.14 76.2,92.71 v74.93,93.98 | v57.79,80.64 56.52,80.64 54.61,82.55 54.61,83.13 IC7.20 54.45,82.97 C53.1 51.65,82.97 52.07,82.55 49.31,82.55 C54.1 | 84.45,80.43 C51.1 | 84.45,80.43 C52.1 89.95,80.43 91.44,81.91 IC5.20 | v74.3,97.79 IC6.10 | v88.27,96.52 IC6.4 89.53,96.52 90.17,95.88 v91.44,95.88 | v70.48,80.01 73.03,80.01 73.66,80.64 78.74,80.64 79.38,80.01 79.38,79.38 80.01,78.74 v80.01,78.11 | v83.82,79.38 83.82,79.8 84.45,80.43 | v130.81,115.57 JP6.3 | v114.94,105.41 v119.38,105.41 | 133.35,103.5 C75.1 | 132.72,104.14 132.72,105.19 C76.1 | C76.1 132.5,104.36 132.72,104.14 | 132.72,104.14 133.35,103.5 | 133.35,103.5 134.62,103.5 135.25,104.14 135.25,106.68 134.3,107.63 U$29.5 | C76.1 131.44,105.41 v130.81,106.05 | 82.97,76.62 C49.1 v83.82,76.62 C50.1
  Bottom 0.406: v87.63,93.34 88.27,93.98 v88.27,96.52 | v91.44,95.88 104.78,95.88 107.31,98.42 115.57,98.42 116.2,99.06 116.2,104.14 v114.94,105.41 J1.79 106.68,105.41 | v57.79,80.64 59.05,79.38 64.77,79.38 65.41,78.74 69.22,78.74 v70.48,80.01 70.48,93.34 71.75,94.61 72.39,94.61 | v80.01,78.11 80.65,78.11 81.92,76.83 82.55,76.83 83.19,77.47 83.19,78.74 v83.82,79.38 84.45,78.74 84.45,77.25 v83.82,76.62 | 72.39,94.61 73.03,94.61 73.66,93.98 v74.93,93.98 | v74.3,97.79 74.3,96.52 72.39,94.61 | v119.38,105.41 130.18,105.41 v130.81,106.05 v130.81,115.57
5VDC  (via drill 0.6)
  Top 0.406: 110.49,20.32 C100.1 | 110.49,20.32 114.81,20.32 C101.1 115.06,20.32 118.75,20.32 120.02,21.59 120.02,27.94 119.38,28.57 | C99.+ 111.76,30.48 113.67,28.57 119.38,28.57 | 119.38,28.57 119.38,30.48 | 119.38,30.48 C98.+ | 110.49,20.32 109.22,20.32 108.59,19.69 v107.31,19.69 | 83.19,26.67 83.19,26.04 | 83.19,26.67 v83.19,29.21 80.01,29.21 79.38,29.85 v79.38,36.83 80.01,37.46 U$11.8 81.34,37.74 C45.1 C46.1 | 119.38,30.48 120.65,30.48 121.92,29.21 127.64,29.21 128.27,29.85 | 128.27,29.85 128.27,31.16 L7.1 | 83.19,26.67 82.59,26.08 L5.1 L6.1 77.52,26.04 79.38,26.04 80.01,25.4 v80.01,20.32 | U$9.8 45.78,20.89 47.56,20.89 v47.62,20.96 | C43.1 40.64,40.22 40.64,38.73 U$10.8 | C43.1 C44.1 | v45.09,25.4 45.72,26.04 45.72,27.94 46.99,29.21 C42.1 C41.1 49.95,25.62 50.8,24.77 52.07,24.77 53.34,23.5 55.25,23.5 v58.42,20.32 | v39.37,40.64 40.01,41.27 40.64,41.27 41.06,40.85 C43.1 | C48.1 C47.1 107.38,56.88 U$12.8 107.95,53.97 108.59,54.61 v108.59,55.24 | 128.27,29.85 v130.18,29.85 | U$8.8 92.71,48.89 93.34,49.53 93.34,51.22 C39.1 C40.1 92.71,54.39 92.71,54.61 v92.08,55.24 | C26.1 C25.1 39.43,59.33 U$1.8 | C26.1 40.01,63.5 39.37,62.86 v39.37,62.23 | C26.1 41.28,63.28 41.28,60.33 41.91,59.69 43.81,59.69 v44.13,60.01 | U$5.8 76.26,69.49 C34.1 C33.1 76.84,73.66 76.2,73.02 v75.56,73.02 | U$2.8 40.7,80.92 C27.1 | C27.1 42.33,82.13 | C28.1 42.55,85.3 42.55,86.36 v42.86,86.68 43.18,87 44.45,87 v44.45,89.53 | C36.1 C35.1 | 119.8,64.41 C36.1 | 119.8,64.41 U$6.8 | 119.8,64.41 119.66,64.41 118.11,62.86 118.11,52.7 117.47,52.07 v116.84,52.07 | C30.1 60.75,73.44 | C30.1 58.84,69.22 U$3.8 57.79,69.22 56.52,67.94 57.15,67.31 56.52,66.67 v56.52,65.41
  Top 0.406: v52.7,53.34 45.72,53.34 45.09,53.97 45.09,54.61 44.45,55.24 44.45,57.15 v45.72,58.42 | 60.75,73.44 C29.1 | v55.88,76.2 57.15,76.2 57.79,76.83 v57.79,78.11 57.79,78.74 58.42,79.38 63.5,79.38 v64.77,78.11 | v55.88,98.42 49.53,98.42 v48.89,97.79 | C30.1 60.75,70.7 62.23,69.22 v64.13,69.22 | v67.31,68.58 67.94,68.58 68.58,69.22 68.58,70.48 69.22,71.12 69.22,73.02 69.85,73.66 69.85,74.93 v71.12,76.2 v74.93,76.2 | 60.75,73.44 v59.69,72.39 | C31.1 C32.1 100.97,71.54 | C27.1 40.64,80.86 40.64,80.64 v42.55,80.64 | 100.97,71.54 100.97,71.75 99.7,71.75 99.06,72.39 v99.7,73.02 | v105.41,73.66 106.05,74.3 107.31,74.3 v112.39,69.22 | v118.75,67.94 118.75,67.73 C36.1 | JP4.3 7.62,116.84 10.8,120.02 C61.+ 15.88,116.08 17.71,114.23 | L4.1 L1.1 34.25,110.53 v34.29,110.49 | C64.1 C63.1 17.71,114.23 | L4.1 C62.+ | L4.1 26.04,111.12 v24.77,112.39 | v16.51,113.03 17.71,114.23 | v87.63,55.24 87.63,57.15 88.27,57.78 90.17,57.78 v90.81,57.15 | 100.97,71.54 100.97,69.91 U$4.8 | L2.1 126.36,112.39 127,113.03 131.44,113.03 135.89,117.47 139.02,117.47 L3.1 140.93,117.52 141.61,116.84 | 141.61,116.84 141.61,111.76 142.24,111.12 142.24,99.69 C88.+ C89.+ 144.14,88.27 142.88,87 v142.88,85.09 | 141.61,116.84 142.24,117.47 142.24,123.19 142.11,123.32 C91.1 C90.1 136.39,123.19 v133.35,123.19 | v43.18,100.33 43.18,93.34 v44.45,92.08 | U$7.8 63.77,53.76 C37.1 C38.1 67.53,53.76 67.31,53.97 67.31,53.34 v68.58,52.07 66.68,53.97 U$7.8
  Bottom 0.406: v107.31,19.69 107.31,23.5 104.78,26.04 104.78,27.94 99.7,33.02 85.09,33.02 83.19,31.11 v83.19,29.21 | v47.62,20.96 47.62,22.23 46.99,22.86 46.36,22.86 45.09,24.13 v45.09,25.4 39.37,31.11 v39.37,40.64 v39.37,62.23 | v80.01,20.32 78.74,19.05 59.69,19.05 v58.42,20.32 | v108.59,55.24 112.39,51.43 114.3,51.43 115.25,50.48 | 115.25,50.48 115.57,50.16 115.57,48.26 132.08,31.75 132.08,30.48 131.44,29.85 v130.18,29.85 | v79.38,36.83 79.38,38.73 78.74,39.37 74.93,39.37 68.58,45.72 v68.58,52.07 72.39,52.07 73.66,53.34 80.65,53.34 81.92,54.61 87,54.61 v87.63,55.24 | 115.25,50.48 v116.84,52.07 125.73,52.07 127,53.34 127,63.5 127.64,64.13 140.34,64.13 142.88,66.67 v142.88,85.09 | v52.7,53.34 56.52,57.15 v56.52,65.41 | v44.13,60.01 v45.72,58.42 | v55.88,76.2 v55.88,98.42 | v64.13,69.22 66.68,69.22 v67.31,68.58 | v59.69,72.39 58.42,73.66 59.05,74.3 59.05,75.56 58.42,76.2 58.42,77.47 v57.79,78.11 | v64.77,78.11 69.22,78.11 v71.12,76.2 | v75.56,73.02 74.93,73.66 v74.93,76.2 | v44.45,89.53 43.18,90.8 43.18,91.44 44.45,92.71 | 44.45,92.71 46.99,95.25 46.99,95.88 v48.89,97.79 | v42.55,80.64 43.18,81.28 43.18,84.45 42.55,85.09 42.55,86.36 v42.86,86.68 | v99.7,73.02 104.78,73.02 v105.41,73.66 | v112.39,69.22 115.57,69.22 117.47,71.12 118.75,71.12 119.38,70.48 119.38,69.22 118.75,68.58 v118.75,67.94 | JP4.3 JP4.2 | v24.77,112.39 17.14,112.39 v16.51,113.03 | v90.81,57.15 92.08,55.88 v92.08,55.24 | v34.29,110.49 34.29,109.22 v43.18,100.33 | 44.45,92.71 v44.45,92.08 | JP9.28 114.3,125.73 115.57,124.46 132.08,124.46 v133.35,123.19
ADC0
  Top 0.406: J3.6 59.05,12.7 55.88,9.53 JP2.2
  Bottom 0.406: J3.6 J3.5
ADC1
  Top 0.406: JP2.1 57.15,7.62 57.15,9.53 60.33,12.7 J3.8
  Bottom 0.406: J3.8 J3.7
ADC2
  Top 0.406: J3.10 61.59,12.7 58.42,9.53 JP2.4
  Bottom 0.406: J3.10 J3.9
ADC3
  Top 0.406: JP2.3 59.69,7.62 59.69,9.53 62.87,12.7 J3.12
  Bottom 0.406: J3.12 J3.11
ADC4
  Top 0.406: J3.14 64.13,12.7 60.96,9.53 JP2.6
  Bottom 0.406: J3.14 J3.13
ADC5
  Top 0.406: JP2.5 62.23,7.62 62.23,9.53 65.41,12.7 J3.16
  Bottom 0.406: J3.16 J3.15
ADC6
  Top 0.406: J3.18 66.68,12.7 63.5,9.53 JP2.8
  Bottom 0.406: J3.18 J3.17
ADC7
  Top 0.406: JP2.7 64.77,7.62 64.77,9.53 67.94,12.7 J3.20
  Bottom 0.406: J3.20 J3.19
ADC8
  Top 0.406: J3.22 69.22,12.7 66.04,9.53 JP2.10
  Bottom 0.406: J3.22 J3.21
ADC9
  Top 0.406: JP2.9 67.31,7.62 67.31,9.53 70.48,12.7 J3.24
  Bottom 0.406: J3.24 J3.23
ADC10
  Top 0.406: J3.26 71.75,12.7 68.58,9.53 JP2.12
  Bottom 0.406: J3.26 J3.25
ADC11
  Top 0.406: JP2.11 69.85,7.62 69.85,9.53 73.03,12.7 J3.28
  Bottom 0.406: J3.28 J3.27
ADC12
  Top 0.406: J3.30 74.3,12.7 71.12,9.53 JP2.14
  Bottom 0.406: J3.30 J3.29
ADC13
  Top 0.406: JP2.13 72.39,7.62 72.39,9.53 75.56,12.7 J3.32
  Bottom 0.406: J3.32 J3.31
ADC14
  Top 0.406: J3.34 76.84,12.7 73.66,9.53 JP2.16
  Bottom 0.406: J3.34 J3.33
ADC15
  Top 0.406: JP2.15 74.93,7.62 74.93,9.53 78.11,12.7 J3.36
  Bottom 0.406: J3.36 J3.35
ADC16
  Top 0.406: J3.38 79.38,12.7 76.2,9.53 JP2.18
  Bottom 0.406: J3.38 J3.37
ADC17
  Top 0.406: JP2.17 77.47,7.62 77.47,9.53 80.65,12.7 J3.40
  Bottom 0.406: J3.40 J3.39
ADC18
  Top 0.406: J3.42 81.92,12.7 78.74,9.53 JP2.20
  Bottom 0.406: J3.42 J3.41
ADC19
  Top 0.406: JP2.19 80.01,7.62 80.01,9.53 83.19,12.7 J3.44
  Bottom 0.406: J3.44 J3.43
ADC20
  Top 0.406: J3.46 84.45,12.7 81.28,9.53 JP2.22
  Bottom 0.406: J3.46 J3.45
ADC21
  Top 0.406: JP2.21 82.55,7.62 82.55,9.53 85.72,12.7 J3.48
  Bottom 0.406: J3.48 J3.47
ADC22
  Top 0.406: J3.50 87,12.7 83.82,9.53 JP2.24
  Bottom 0.406: J3.50 J3.49
ADC23
  Top 0.406: JP2.23 85.09,7.62 85.09,9.53 88.27,12.7 J3.52
  Bottom 0.406: J3.52 J3.51
ADC24
  Top 0.406: J3.54 89.53,12.7 86.36,9.53 JP2.26
  Bottom 0.406: J3.54 J3.53
ADDR0
  Top 0.406: S5.7 18.42,29.85 20.96,32.38 20.96,45.72 21.59,46.35 J4.62
  Bottom 0.406: J4.62 J4.61 R126.2
ADDR1
  Top 0.406: S5.8 18.42,32.38 19.69,33.66 19.69,45.72 21.59,47.62 J4.60
  Bottom 0.406: J4.60 J4.59 R125.2
ADDR2
  Top 0.406: S5.9 17.14,34.92 18.42,36.2 18.42,46.35 20.96,48.89 J4.58
  Bottom 0.406: J4.58 J4.57 R124.2
ADDR3
  Top 0.406: S5.10 15.88,37.46 17.14,38.73 17.14,46.99 20.32,50.16 J4.56
  Bottom 0.406: J4.56 J4.55 R123.2
ADDR4
  Top 0.406: S5.11 14.61,40 15.88,41.27 15.88,48.26 19.05,51.43 J4.54
  Bottom 0.406: J4.54 J4.53 R122.2
ADDREN
  Top 0.406: S5.12 13.34,42.54 14.61,43.81 14.61,48.89 18.42,52.7 J4.52
  Bottom 0.406: J4.52 J4.51 R121.2
AMPOUT_EN
  Top 0.406: S1.3 93.34,11.43 94.61,12.7 J3.62
  Bottom 0.406: J3.62 J3.61 94.61,19.05 93.34,20.32 R104.2
AMPOUTN
  Top 0.406: J3.64 95.89,13.33 JP1.6
  Bottom 0.406: J3.64 J3.63
AMPOUTP
  Top 0.406: J3.66 97.16,13.33 99.7,10.79 100.97,10.79 JP1.5
  Bottom 0.406: J3.66 J3.65
ANALOG0  (via drill 0.6)
  Top 0.406: R2.2 30.7,59.05 U$1.1 34.23,60.9 v36.83,63.5 | IC1.9 39.37,90.17 v34.92,85.72 | v29.21,80.01 29.21,71.75 30.48,70.48 33.02,70.48 33.66,69.85 33.66,68.8 R3.1 v35.56,68.58
  Bottom 0.406: v29.21,80.01 v34.92,85.72 | v36.83,63.5 36.83,64.13 36.2,64.77 36.2,67.94 v35.56,68.58 | JP9.1 45.72,125.73 45.09,125.09 41.28,125.09 40.64,124.46 40.64,120.65 39.37,119.38 IC1.9
ANALOG1  (via drill 0.6)
  Top 0.406: R5.2 42.97,57.78 U$1.7 43.18,57.78 46.36,60.96 46.36,69.85 45.72,70.48 v43.18,70.48 40.64,70.48 40.01,69.85 40.01,69.22 39.79,69 R6.1 | IC1.10 41.91,86.36 v40.64,85.09
  Bottom 0.406: v40.64,85.09 40.64,80.01 43.18,77.47 v43.18,70.48 | JP9.2 48.26,126.37 45.72,123.83 45.72,120.65 41.91,116.84 IC1.10
ANALOG2  (via drill 0.6)
  Top 0.406: R8.2 31.97,80.64 U$2.1 35.5,82.61 v32.39,85.72 R9.1 | v44.45,95.88 IC1.11
  Bottom 0.406: v44.45,95.88 43.18,94.61 41.28,94.61 v32.39,85.72 | JP9.3 50.8,126.37 48.26,123.83 48.26,120.65 44.45,116.84 IC1.11
ANALOG3  (via drill 0.6)
  Top 0.406: R11.2 40.92,79.59 U$2.7 39.37,79.38 v38.42,80.33 36.2,82.55 36.2,85.09 37.25,86.14 R12.1 | IC1.12 46.99,113.66 45.09,111.76 45.09,97.16 45.72,96.52 v45.72,88.27
  Bottom 0.406: v38.42,80.33 38.73,80.64 38.73,87 40.01,88.27 41.91,88.27 43.18,89.53 44.45,88.27 v45.72,88.27 | JP9.4 53.34,126.37 50.8,123.83 50.8,120.65 46.99,116.84 IC1.12
ANALOG4  (via drill 0.6)
  Top 0.406: 52.07,69.22 U$3.1 53.98,69.22 53.98,75.56 55.88,77.47 55.88,80.01 54.61,81.28 R15.1 | 52.07,69.22 49.53,66.67 R14.2 | 52.07,69.22 48.89,72.39 47.62,72.39 v46.99,71.75 | IC1.13 49.53,113.66 48.89,113.03 47.62,113.03 45.72,111.12 45.72,97.79 46.36,97.16 46.36,89.53 46.99,88.9 v46.99,87.63
  Bottom 0.406: v46.99,87.63 45.72,86.36 45.72,83.82 46.99,82.55 46.36,81.91 46.36,81.28 46.99,80.64 48.26,80.64 48.89,81.28 50.16,80.01 47.62,77.47 47.62,73.02 46.99,72.39 v46.99,71.75 | JP9.5 55.88,126.37 53.34,123.83 53.34,120.65 49.53,116.84 IC1.13
ANALOG5  (via drill 0.6)
  Top 0.406: IC1.14 52.07,113.66 51.44,113.03 50.16,113.03 49.53,112.39 48.26,112.39 46.36,110.49 46.36,98.42 46.99,97.79 46.99,90.17 47.62,89.53 47.62,88.27 48.26,87.63 48.26,85.72 47.62,85.09 47.62,74.3 48.26,73.66 v52.7,73.66 | v55.25,73.02 58.42,73.02 | 58.42,73.02 59.05,73.02 59.69,73.66 R18.1 | v60.96,69.22 60.96,67.94 | v59.05,71.12 58.42,71.75 58.42,73.02 | 60.96,67.94 U$3.7 | 60.96,67.94 62.65,67.94 R17.2
  Bottom 0.406: v52.7,73.66 54.61,73.66 v55.25,73.02 | v59.05,71.12 v60.96,69.22 | JP9.6 58.42,126.37 55.88,123.83 55.88,120.65 52.07,116.84 IC1.14
ANALOG6  (via drill 0.6)
  Top 0.406: R20.2 94.97,70.7 U$4.1 96.52,69.22 98.42,71.12 98.42,73.88 98.22,74.08 | IC1.15 54.61,110.49 57.79,107.31 106.68,107.31 107.95,106.05 v107.95,93.98 | 98.22,74.08 v99.06,74.93 | R21.1 98,74.3 98.22,74.08
  Bottom 0.406: v107.95,93.98 107.95,76.2 106.68,74.93 v99.06,74.93 | JP9.7 60.96,125.73 58.42,123.19 58.42,120.65 54.61,116.84 IC1.15
ANALOG7  (via drill 0.6)
  Top 0.406: IC1.16 57.15,109.86 59.05,107.95 107.31,107.95 108.59,106.68 108.59,94.61 v109.22,93.98 | v109.22,80.64 108.59,80.01 104.78,80.01 104.14,80.64 101.6,80.64 100.97,80.01 100.97,79.59 R24.1 | U$4.7 100.33,67.94 99.7,68.58 v99.7,70.48 | 105.41,71.97 v105.41,72.39 105.41,71.75 105.83,71.33 R23.2
  Bottom 0.406: v109.22,93.98 v109.22,80.64 108.59,80.01 108.59,75.56 v105.41,72.39 104.78,71.75 100.33,71.75 99.7,71.12 v99.7,70.48 | JP9.8 63.5,125.09 62.23,123.83 62.23,121.28 57.15,116.2 IC1.16
ANALOG8  (via drill 0.6)
  Top 0.406: R26.2 67.94,67.31 69.85,69.22 | 69.85,69.22 U$5.1 | IC2.9 60.96,110.49 62.87,108.58 107.95,108.58 109.22,107.31 109.22,95.88 110.49,94.61 v110.49,93.98 | v109.86,78.11 109.22,78.74 105.41,78.74 104.78,78.11 v104.14,78.11 | 69.85,69.22 69.85,72.39 70.48,73.02 70.48,74.3 71.75,75.56 73.66,75.56 74.51,74.72 R27.1 75.15,74.93 80.65,74.93 81.28,75.56 86.36,75.56 87,76.2 87,77.47 87.63,78.11 91.44,78.11 92.08,77.47 94.61,77.47 95.25,78.11 97.16,78.11 v97.79,77.47
  Bottom 0.406: v110.49,93.98 110.49,78.74 v109.86,78.11 | v104.14,78.11 100.33,78.11 99.7,77.47 v97.79,77.47 | JP9.9 66.04,125.09 64.77,123.83 64.77,121.28 60.96,117.47 IC2.9
ANALOG9  (via drill 0.6)
  Top 0.406: 77.47,68.16 76.47,68.16 U$5.7 74.93,67.94 74.3,68.58 74.3,69.22 v75.56,70.48 | 77.47,68.16 R29.2 | IC2.10 63.5,111.12 65.41,109.22 108.59,109.22 109.86,107.95 109.86,96.52 111.76,94.61 v111.76,93.98 | v96.52,76.83 88.9,76.83 87,74.93 83.19,74.93 v81.28,73.02 | v78.74,69.22 78.53,69.22 77.47,68.16 | R30.1 75.56,78.74 v74.93,78.11 | v105.41,76.2 v110.49,76.2
  Bottom 0.406: v111.76,93.98 111.76,77.47 v110.49,76.2 | v105.41,76.2 97.16,76.2 v96.52,76.83 | v81.28,73.02 81.28,70.48 80.01,69.22 v78.74,69.22 | v74.93,78.11 74.93,77.47 76.84,75.56 76.84,71.75 v75.56,70.48 | JP9.10 68.58,125.09 67.31,123.83 67.31,121.28 63.5,117.47 IC2.10
ANALOG10  (via drill 0.6)
  Top 0.406: R32.2 113.25,64.13 U$6.1 114.88,64.71 116.84,66.67 116.84,69.85 116.2,70.48 R33.1 115.57,70.7 115.57,71.75 113.03,74.3 v113.03,77.47 | IC2.11 66.04,111.12 67.31,109.86 109.22,109.86 110.49,108.58 110.49,97.16 113.03,94.61 v113.03,93.98
  Bottom 0.406: v113.03,93.98 v113.03,77.47 | JP9.11 71.12,125.09 69.85,123.83 69.85,121.28 66.04,117.47 IC2.11
ANALOG11  (via drill 0.6)
  Top 0.406: U$6.7 121.92,62.86 122.56,63.5 122.56,64.77 123.19,65.41 | 123.19,65.41 123.61,65.41 R35.2 | 123.19,65.41 122.56,66.04 122.56,70.48 121.92,71.12 121.92,74.93 121.28,75.56 118.75,75.56 118.53,75.35 R36.1 115.57,74.3 114.3,75.56 v114.3,77.47 | IC2.12 68.58,111.76 69.85,110.49 109.86,110.49 111.12,109.22 111.12,97.79 114.3,94.61 v114.3,93.98
  Bottom 0.406: v114.3,93.98 v114.3,77.47 | JP9.12 73.66,125.09 72.39,123.83 72.39,121.28 68.58,117.47 IC2.12
ANALOG12  (via drill 0.6)
  Top 0.406: 57.79,53.97 55.88,53.97 54.61,52.7 54.61,47.62 52.07,45.09 52.07,43.18 | 57.79,53.97 U$7.1 | 52.07,43.18 R38.2 | R39.1 57.79,55.66 57.79,53.97 | IC2.13 71.12,116.2 70.48,116.84 38.73,116.84 38.1,116.2 38.1,90.17 35.56,87.63 27.3,87.63 26.04,86.36 21.59,86.36 20.96,85.72 v20.96,80.01 | v15.24,33.66 v17.78,33.66 | v36.83,49.53 40.01,49.53 40.64,50.16 v41.28,50.16 | v46.99,43.18 52.07,43.18
  Bottom 0.406: v20.96,80.01 20.96,46.99 20.32,46.35 19.69,46.35 15.24,41.91 v15.24,33.66 | v17.78,33.66 27.3,33.66 27.94,34.29 27.94,43.18 29.21,44.45 36.2,44.45 36.83,45.09 v36.83,49.53 | v41.28,50.16 43.81,50.16 43.81,46.35 v46.99,43.18 | JP9.13 76.2,125.09 74.93,123.83 74.93,121.28 71.12,117.47 IC2.13
ANALOG13  (via drill 0.6)
  Top 0.406: 69.22,48.26 67.94,48.26 67.31,48.89 67.31,50.16 64.77,52.7 U$7.7 | R42.1 60.96,58 60.96,58.42 61.59,59.05 68.58,59.05 71.12,56.52 | 71.12,56.52 71.12,51.43 69.22,49.53 69.22,48.26 | IC2.14 73.66,112.39 74.93,111.12 110.49,111.12 111.76,109.86 111.76,98.42 115.57,94.61 v115.57,93.98 | v97.16,60.33 79.38,60.33 75.56,56.52 71.12,56.52 | 69.22,48.26 74.51,48.26 R41.2
  Bottom 0.406: v115.57,93.98 115.57,77.47 116.84,76.2 115.57,74.93 115.57,74.3 113.67,72.39 110.49,72.39 104.14,66.04 103.5,66.04 102.23,64.77 102.23,64.13 99.7,61.59 98.42,61.59 v97.16,60.33 | JP9.14 78.74,125.09 77.47,123.83 77.47,121.28 73.66,117.47 IC2.14
ANALOG14  (via drill 0.6)
  Top 0.406: U$8.1 84.67,48.89 R44.2 R45.1 86.36,54.82 v86.36,59.05 | IC2.15 76.2,113.03 77.47,111.76 111.12,111.76 112.39,110.49 112.39,99.06 116.84,94.61 v116.84,93.98 | v112.39,71.12 111.76,71.75 111.76,73.02 v111.12,73.66 | v86.36,61.59 86.36,66.04 87,66.67 90.81,66.67 91.44,66.04 91.44,64.13 93.34,62.23 94.61,63.5 v95.89,63.5
  Bottom 0.406: v112.39,71.12 113.67,71.12 116.84,74.3 116.84,74.93 117.47,75.56 117.47,76.83 116.84,77.47 v116.84,93.98 | v111.12,73.66 109.86,73.66 99.7,63.5 v95.89,63.5 | v86.36,59.05 v86.36,61.59 | JP9.15 81.28,125.09 80.01,123.83 80.01,121.28 76.2,117.47 IC2.15
ANALOG15  (via drill 0.6)
  Top 0.406: R47.2 94.83,49.11 93.34,47.62 U$8.7 90.81,47.62 90.17,48.26 90.17,49.53 91.44,50.8 91.44,54.61 90.81,55.24 92.08,56.52 92.08,58.42 | R48.1 92.71,59.05 92.08,58.42 | IC2.16 78.74,113.03 79.38,112.39 111.76,112.39 113.03,111.12 113.03,99.69 118.11,94.61 v118.11,93.98 | v98.42,60.33 97.16,61.59 96.52,61.59 95.89,60.96 92.08,60.96 v91.44,61.59 | 92.08,58.42 v91.44,59.05
  Bottom 0.406: v98.42,60.33 99.7,59.05 111.76,59.05 120.02,67.31 120.02,75.56 118.11,77.47 v118.11,93.98 | v91.44,59.05 v91.44,61.59 | JP9.16 83.82,125.09 83.19,124.46 81.92,124.46 81.28,123.83 81.28,119.38 78.74,116.84 IC2.16
ANALOG16  (via drill 0.6)
  Top 0.406: 39.37,27.3 R51.1 | 39.37,27.3 38.73,26.67 R50.2 38.95,24.77 39.37,24.77 40.01,24.13 40.01,22.86 40.58,22.29 U$9.1 | IC3.9 82.55,116.84 81.92,117.47 38.1,117.47 37.47,116.84 37.47,90.8 34.92,88.27 26.67,88.27 25.4,87 20.96,87 20.32,86.36 20.32,81.28 v19.69,80.64 | v15.24,31.11 v17.78,31.11 | v35.56,27.3 39.37,27.3
  Bottom 0.406: v19.69,80.64 19.69,47.62 13.97,41.91 13.97,32.38 v15.24,31.11 | v17.78,31.11 31.75,31.11 v35.56,27.3 | JP9.17 86.36,126.37 83.82,123.83 83.82,121.28 82.55,120.02 IC3.9
ANALOG17  (via drill 0.6)
  Top 0.406: R54.1 48.89,34.29 48.26,33.66 v48.26,31.75 | v48.26,27.94 47.62,27.3 R53.2 | v48.89,19.69 U$9.7 45.09,19.69 43.81,20.96 v42.55,20.96 | IC3.10 85.09,116.84 83.82,118.11 37.47,118.11 36.83,117.47 36.83,103.5 v36.2,102.87 | v32.39,28.57 27.94,33.02 27.94,43.81 27.3,44.45 27.3,80.64 v27.94,81.28
  Bottom 0.406: v48.26,31.75 v48.26,27.94 48.89,27.94 49.53,27.3 49.53,20.32 v48.89,19.69 | v36.2,102.87 36.2,90.8 34.29,88.9 28.58,88.9 27.94,88.27 v27.94,81.28 | v32.39,28.57 34.29,26.67 34.29,26.04 39.37,20.96 v42.55,20.96 | JP9.18 88.9,126.37 86.36,123.83 86.36,121.28 85.09,120.02 IC3.10
ANALOG18  (via drill 0.6)
  Top 0.406: R56.2 30.7,38.73 33.66,38.73 | 33.66,38.73 U$10.1 34.29,38.79 34.29,43.18 33.02,44.45 R57.1 | IC3.11 87.63,116.84 85.72,118.75 36.83,118.75 36.2,118.11 36.2,104.77 v35.56,104.14 | v26.67,29.85 v26.67,32.38 | v31.75,40 32.39,40 33.66,38.73
  Bottom 0.406: v35.56,104.14 34.92,103.5 34.92,102.23 35.56,101.6 35.56,91.44 33.66,89.53 27.94,89.53 26.67,88.27 26.67,86.36 26.04,85.72 19.05,85.72 17.78,84.45 17.78,80.64 19.05,79.38 19.05,48.26 13.34,42.54 13.34,27.94 12.07,26.67 12.07,24.13 12.7,23.5 20.32,23.5 v26.67,29.85 | v26.67,32.38 29.84,32.38 30.48,33.02 30.48,38.73 v31.75,40 | JP9.19 91.44,126.37 88.9,123.83 88.9,121.28 87.63,120.02 IC3.11
ANALOG19  (via drill 0.6)
  Top 0.406: R59.2 41.49,37.68 41.28,37.46 U$10.7 38.1,37.46 37.47,38.1 37.47,39.37 38.1,40 38.1,44.45 | R60.1 38.1,46.57 38.1,44.45 | IC3.12 90.17,116.84 87.63,119.38 36.2,119.38 35.56,118.75 35.56,106.05 v34.29,104.77 | 38.1,44.45 36.2,46.35 30.48,46.35 29.84,45.72 29.21,45.72 28.58,45.09 28.58,43.18 v29.21,42.54 | v36.83,25.4 36.83,24.77 37.47,24.13 v37.47,20.32
  Bottom 0.406: v34.29,104.77 33.02,103.5 27.94,103.5 25.4,100.97 25.4,99.06 24.77,98.42 24.77,92.71 17.14,85.09 17.14,80.01 18.42,78.74 18.42,48.89 12.7,43.18 12.7,28.57 11.43,27.3 11.43,23.5 12.07,22.86 19.05,22.86 29.21,12.7 29.84,12.7 v37.47,20.32 | v29.21,42.54 29.21,41.91 29.84,41.27 34.92,41.27 36.2,40 36.2,28.57 36.83,27.94 v36.83,25.4 | JP9.20 93.98,126.37 91.44,123.83 91.44,121.28 90.17,120.02 IC3.12
ANALOG20  (via drill 0.6)
  Top 0.406: U$11.1 72.61,37.46 R62.2 72.39,38.1 73.03,38.73 73.03,43.81 73.66,44.45 74.51,44.45 R63.1 76.2,43.6 76.2,45.09 76.84,45.72 80.01,45.72 80.65,46.35 80.65,53.34 81.92,54.61 83.82,54.61 85.09,55.88 v85.09,59.05 | IC3.13 92.71,113.66 93.34,113.03 112.39,113.03 113.67,111.76 113.67,100.33 119.38,94.61 v119.38,93.98 | v104.14,79.38 v119.38,79.38 | v98.42,79.38 97.79,78.74 94.61,78.74 93.98,78.11 92.71,78.11 91.44,79.38 v87,79.38
  Bottom 0.406: v119.38,79.38 v119.38,93.98 | v85.09,59.05 85.09,63.5 87.63,66.04 87.63,71.75 88.27,72.39 88.27,73.02 87.63,73.66 87.63,78.74 v87,79.38 | v104.14,79.38 103.5,78.74 99.06,78.74 v98.42,79.38 | JP9.21 96.52,126.37 93.98,123.83 93.98,121.28 92.71,120.02 IC3.13
ANALOG21  (via drill 0.6)
  Top 0.406: R65.2 84.88,36.2 83.19,36.2 | U$11.7 83.19,36.2 | R66.1 80.86,43.81 v81.92,43.81 85.72,43.81 86.36,43.18 v86.36,39.37 | 83.19,36.2 v83.19,37.46 | v81.92,61.59 81.92,71.12 82.55,71.75 85.72,71.75 86.36,71.12 87.63,71.12 88.27,71.75 v91.44,71.75 | v81.92,59.05 81.92,55.88 80.01,53.97 80.01,47.62 v79.38,46.99 | v91.44,80.64 v97.16,80.64
  Bottom 0.406: v86.36,39.37 84.45,37.46 v83.19,37.46 | v97.16,80.64 95.89,81.91 95.89,85.72 107.95,97.79 116.2,97.79 116.84,98.42 116.84,105.41 114.94,107.31 98.42,107.31 95.25,110.49 IC3.14 95.25,120.02 96.52,121.28 96.52,123.83 99.06,126.37 JP9.22 | v81.92,59.05 v81.92,61.59 | v79.38,46.99 79.38,45.09 80.75,43.71 81.17,43.71 81.28,43.81 v81.92,43.81 | v91.44,80.64 91.44,78.74 92.71,78.74 93.98,77.47 93.98,74.93 92.71,73.66 92.71,73.02 v91.44,71.75
ANALOG22  (via drill 0.6)
  Top 0.406: R68.2 99.91,53.97 U$12.1 103.5,55.3 103.5,58.42 102.45,59.47 R69.1 102.87,60.11 v102.87,60.96 | v106.68,77.47 104.78,77.47 104.14,76.83 104.14,70.48 104.78,69.85 104.78,66.04 103.5,64.77 v103.5,64.13
  Bottom 0.406: v102.87,60.96 103.5,61.59 v103.5,64.13 | v106.68,77.47 106.68,80.01 107.31,80.64 107.31,81.91 106.68,82.55 106.68,91.44 107.31,92.08 107.31,93.34 106.68,93.98 106.68,95.25 108.59,97.16 116.84,97.16 117.47,97.79 117.47,106.05 115.57,107.95 99.7,107.95 97.79,109.86 IC3.15 97.79,120.02 99.06,121.28 99.06,123.83 101.6,126.37 JP9.23
ANALOG23  (via drill 0.6)
  Top 0.406: R71.2 110.7,54.82 109.86,53.97 109.86,53.34 109.22,52.7 U$12.7 106.05,52.7 105.41,53.34 v105.41,62.86 105.41,63.5 106.68,64.77 R72.1 | v120.02,77.47 116.84,77.47 v115.57,76.2 | v109.86,70.48 v107.31,73.02
  Bottom 0.406: v120.02,77.47 120.65,78.11 120.65,94.61 118.11,97.16 118.11,106.68 116.2,108.58 101.6,108.58 100.33,109.86 IC3.16 100.33,120.02 101.6,121.28 101.6,123.83 104.14,126.37 JP9.24 | v115.57,76.2 112.39,76.2 111.12,74.93 110.49,74.93 109.86,74.3 108.59,74.3 v107.31,73.02 | v105.41,62.86 105.41,63.5 106.68,64.77 106.68,66.67 107.95,67.94 107.95,68.58 v109.86,70.48
BREAKOUT0
  Top 0.406: IC7.13 55.88,92.08 58.42,94.61 58.42,97.79 57.79,98.42 57.79,100.33 56.52,101.6 J1.2
  Bottom 0.406: J1.2 J1.1
BREAKOUT1
  Top 0.406: IC7.14 55.88,90.8 59.05,93.98 59.05,98.42 58.42,99.06 58.42,100.97 57.79,101.6 J1.4
  Bottom 0.406: J1.4 J1.3
BREAKOUT2
  Top 0.406: IC7.15 55.88,89.53 59.69,93.34 59.69,99.06 59.05,99.69 J1.6
  Bottom 0.406: J1.6 J1.5
BREAKOUT3
  Top 0.406: IC7.16 55.88,88.27 60.33,92.71 60.33,99.69 59.69,100.33 59.69,100.97 60.33,101.6 J1.8
  Bottom 0.406: J1.8 J1.7
BREAKOUT4
  Top 0.406: IC7.17 55.88,87 60.96,92.08 60.96,100.97 61.59,101.6 J1.10
  Bottom 0.406: J1.10 J1.9
BREAKOUT5
  Top 0.406: IC7.18 55.88,85.72 62.23,92.08 62.23,101.6 62.87,102.23 J1.12
  Bottom 0.406: J1.12 J1.11
BREAKOUT6  (via drill 0.6)
  Top 0.406: J1.14 64.13,101.6 64.77,100.97 66.68,100.97 67.31,100.33 67.31,97.16 67.94,96.52 IC6.11 80.01,96.52 81.28,95.25 v81.28,94.61 | v81.28,97.79 IC6.5
  Bottom 0.406: J1.14 J1.13 | v81.28,97.79 v81.28,94.61 81.28,93.98
BREAKOUTBAR0
  Top 0.406: IC7.7 IC5.13 95.25,90.8 95.89,91.44 J1.64
  Bottom 0.406: J1.64 J1.63
BREAKOUTBAR1
  Top 0.406: J1.66 97.16,91.44 95.25,89.53 IC5.14 86.36,89.53 85.72,90.17 84.45,90.17 83.82,89.53 73.03,89.53 72.39,90.17 71.12,90.17 70.48,89.53 IC7.6
  Bottom 0.406: J1.66 J1.65
BREAKOUTBAR2
  Top 0.406: J1.68 98.42,91.44 95.25,88.27 IC5.15 86.36,88.27 85.72,87.63 84.45,87.63 83.82,88.27 73.03,88.27 72.39,87.63 71.12,87.63 70.48,88.27 IC7.5
  Bottom 0.406: J1.68 J1.67
BREAKOUTBAR3
  Top 0.406: J1.70 99.7,91.44 95.25,87 IC5.16 92.71,87 92.08,87.63 90.81,87.63 90.17,87 82.55,87 81.92,87.63 80.65,87.63 80.01,87 IC7.4
  Bottom 0.406: J1.70 J1.69
BREAKOUTBAR4
  Top 0.406: J1.72 100.97,91.44 95.25,85.72 IC5.17 92.71,85.72 92.08,85.09 90.81,85.09 90.17,85.72 82.55,85.72 81.92,85.09 80.65,85.09 80.01,85.72 IC7.3
  Bottom 0.406: J1.72 J1.71
BREAKOUTBAR5
  Top 0.406: IC7.2 IC5.18 95.25,84.45 102.23,91.44 J1.74
  Bottom 0.406: J1.74 J1.73
BREAKOUTBAR6  (via drill 0.6)
  Top 0.406: 83.19,99.06 IC6.6 87.63,99.06 v88.27,98.42 89.53,97.16 v93.34,97.16 | 83.19,93.98 IC6.2 86.36,93.98 v87,94.61 | v103.5,99.06 J1.76 | v114.94,100.97 120.02,100.97 120.65,101.6 120.65,111.12 118.75,113.03 117.47,113.03 116.84,113.66 IC4.14
  Bottom 0.406: v93.34,97.16 101.6,97.16 v103.5,99.06 113.03,99.06 v114.94,100.97 | v87,94.61 87,97.16 v88.27,98.42 | J1.76 J1.75 | JP9.25 106.68,125.09 107.95,123.83 107.95,120.02 110.49,117.47 115.57,117.47 116.84,116.2 IC4.14
CLKEN
  Top 0.406: J3.58 92.08,12.55 S1.4
  Bottom 0.406: J3.58 J3.57 92.08,19.05 90.81,20.32 R103.2
COMP_FDTHRU
  Top 0.406: S7.4 10.65,83.33 20.96,73.02 J4.20
  Bottom 0.406: J4.20 J4.19 R108.2
CONFIG0
  Top 0.406: S6.13 14.61,50.8 17.78,53.97 J4.50
  Bottom 0.406: J4.50 J4.49 R120.2
CONFIG1
  Top 0.406: S6.14 15.24,53.34 17.14,55.24 J4.48
  Bottom 0.406: J4.48 J4.47 R119.2
CONFIG2
  Top 0.406: S6.15 15.88,55.88 16.51,56.52 J4.46
  Bottom 0.406: J4.46 J4.45 R118.2
CONFIG3
  Top 0.406: S6.16 15.88,58.42 16.51,57.78 J4.44
  Bottom 0.406: J4.44 J4.43 R117.2
CONFIG4
  Top 0.406: S6.17 15.24,60.96 17.14,59.05 J4.42
  Bottom 0.406: J4.42 J4.41 R116.2
CONFIG5
  Top 0.406: S6.18 14.61,63.5 17.78,60.33 J4.40
  Bottom 0.406: J4.40 J4.39 R115.2
CONFIG6
  Top 0.406: S6.19 13.97,66.04 18.42,61.59 J4.38
  Bottom 0.406: J4.38 J4.37 R114.2
CONFIG7
  Top 0.406: S6.20 13.34,68.58 19.05,62.86 J4.36
  Bottom 0.406: J4.36 J4.35 R113.2
CONFIG8
  Top 0.406: S6.21 12.7,71.12 19.69,64.13 J4.34